# EAGLE schematic TX (EAGLE 6.4)
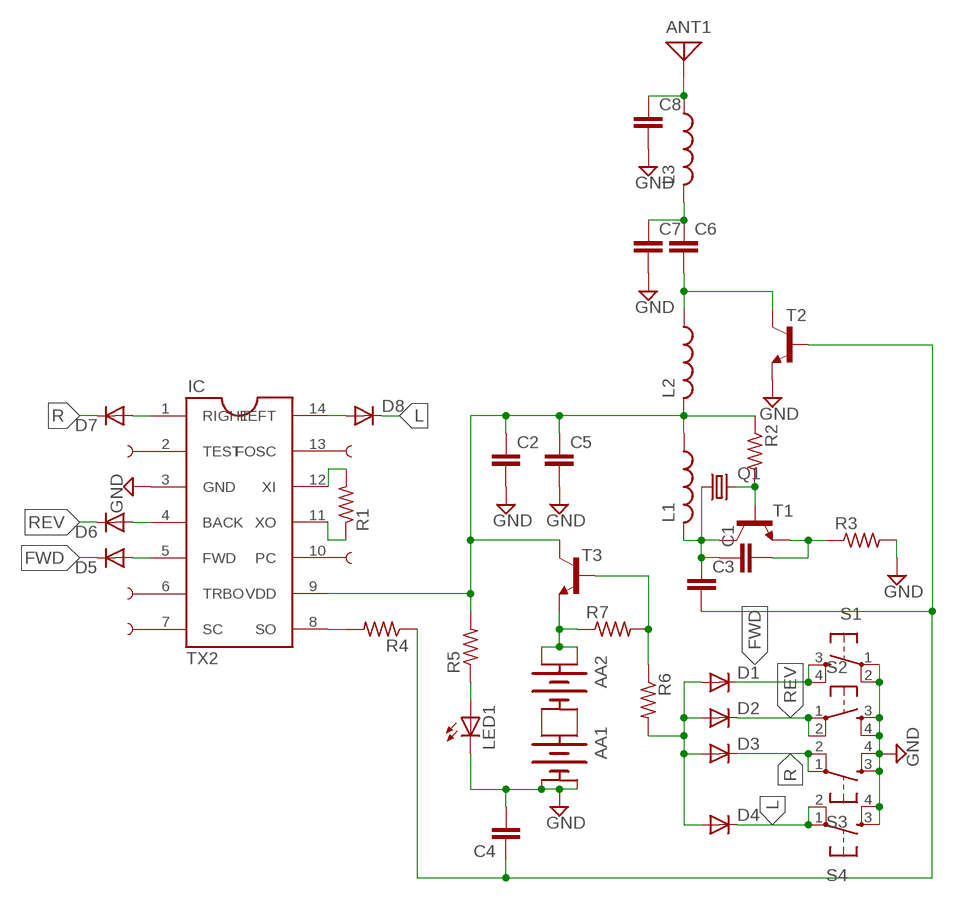
[diagram p0: schematic, sheet 1]

## Parts
AA1  BATTERY-2AA  [BATTERY-AA]
AA2  BATTERY-2AA  [BATTERY-AA]
ANT1  ANTENNA  [PAD-01]
C1  C-EU050-025X075  [C050-025X075]
C2  C-EU050-025X075  [C050-025X075]
C3  C-EU050-025X075  [C050-025X075]
C4  C-EU050-025X075  [C050-025X075]
C5  C-EU050-025X075  [C050-025X075]
C6  C-EU050-025X075  [C050-025X075]
C7  C-EU050-025X075  [C050-025X075]
C8  C-EU050-025X075  [C050-025X075]
D1  DIODE-DO35-10  [DO35-10]
D2  DIODE-DO35-10  [DO35-10]
D3  DIODE-DO35-10  [DO35-10]
D4  DIODE-DO35-10  [DO35-10]
D5  DIODE-DO35-10  [DO35-10]
D6  DIODE-DO35-10  [DO35-10]
D7  DIODE-DO35-10  [DO35-10]
D8  DIODE-DO35-10  [DO35-10]
IC  TX2  TX2TX2  [14-DIP]
L1  L-US0204/7  [0204/7]
L2  L-US0204/7  [0204/7]
L3  L-US6000-XXX-RC  [6000-XXXX-RC]
LED1  LED5MM  [LED5MM]
Q1  CRYSTALTC38H  [TC38H]
R1  R-US_0204/7  [0204/7]
R2  R-US_0204/7  [0204/7]
R3  R-US_0204/7  [0204/7]
R4  R-US_0204/7  [0204/7]
R5  R-US_0204/7  [0204/7]
R6  R-US_0204/7  [0204/7]
R7  R-US_0204/7  [0204/7]
S1  TAC_SWITCHPTH  [TACTILE-PTH]
S2  TAC_SWITCHPTH  [TACTILE-PTH]
S3  TAC_SWITCHPTH  [TACTILE-PTH]
S4  TAC_SWITCHPTH  [TACTILE-PTH]
T1  2SC1815  [TO92-ECB]
T2  2SC1815  [TO92-ECB]
T3  2SC1815  [TO92-ECB]
TP1  TEST-POINT3  [PAD.03X.03]
TP2  TEST-POINT3  [PAD.03X.03]
TP3  TEST-POINT3  [PAD.03X.03]
TP4  TEST-POINT3  [PAD.03X.03]
TP5  TEST-POINT3  [PAD.03X.03]

## Nets
FWD: D1.C D5.C S1.3 S1.4
GND: AA1.GND@1(-1) AA1.GND@2(-2) C2.2 C4.2 C5.2 C7.2 C8.2 IC.3(GND) LED1.K(C) R3.2 S1.1 S1.2 S2.3 S2.4 S3.3 S3.4 S4.3 S4.4 T2.E
L: D4.C D8.C S4.1 S4.2
N$1: AA1.PWR@2(+2) AA2.GND@2(-2)
N$2: AA1.PWR@1(+1) AA2.GND@1(-1)
N$3: ANT1.1 C8.1 L3.1
N$4: C6.1 C7.1 L3.2
N$5: C6.2 L2.1 T2.C
N$6: IC.13(FOSC) TP1.P$1
N$7: IC.10(PC) TP2.P$1
N$8: IC.2(TEST) TP3.P$1
N$9: IC.6(TRBO) TP4.P$1
N$10: IC.7(SC) TP5.P$1
N$11: C2.1 C5.1 IC.9(VDD) L1.1 L2.2 R2.1 R5.2 T3.C
N$12: LED1.A R5.1
N$13: AA2.PWR@1(+1) AA2.PWR@2(+2) R7.1 T3.E
N$14: Q1.2 R2.2 T1.B
N$15: R6.1 R7.2 T3.B
N$16: D1.A D2.A D3.A D4.A R6.2
N$17: C3.2 C4.1 R4.1 T2.B
N$18: C1.1 C3.1 L1.2 Q1.1 T1.C
N$19: IC.8(SO) R4.2
N$20: C1.2 R3.1 T1.E
N$21: D5.A IC.5(FWD)
N$22: D7.A IC.1(RIGHT)
N$23: D8.A IC.14(LEFT)
N$24: D6.A IC.4(BACK)
N$25: IC.12(XI) R1.2
N$26: IC.11(XO) R1.1
R: D3.C D7.C S3.1 S3.2
REV: D2.C D6.C S2.1 S2.2

## Library data of the parts
AA1 AA2 = SparkFun-Electromechanical:BATTERY-2: AA and AAA battery holders
ANT1 = discrete:ANTENNA: Antenna
C1-C8 = resistor:C-EU: CAPACITOR, European symbol
D1-D8 = diode:DIODE-: DIODE
IC = Dan:TX2
L1-L3 = rcl:L-US: INDUCTOR, American symbol
LED1 = led:LED: LED OSRAM: - CHIPLED LG R971, LG N971, LY N971, LG Q971, LY Q971, LO R971, LY R971 LH N974, LH R974 LS Q976, LO Q976, LY Q976 LO Q996 - Hyper CHIPLED LW Q18S LB Q993, LB Q99A, LB R99A - SideLED LS A670, LO A670, LY A670, LG A670, LP A670 LB A673, LV A673, LT A673, LW A673 LH A674 LY A675 LS A676, LA A676, LO A676, LY A676, LW A676 LS A679, LY A679, LG A679 - Hyper Micro SIDELED® LS Y876, LA Y876, LO Y876, LY Y876 LT Y87S - SmartLED LW L88C, LW L88S LB L89C, LB L89S, LG L890 LS L89K, LO L89K, LY L89K LS L896, LA L896, LO L896, LY L896 - TOPLED LS T670, LO T670, LY T670, LG T670, LP T670 LSG T670, LSP T670, LSY T670, LOP T670, LYG T670 LG T671, LOG T671, LSG T671 LB T673, LV T673, LT T673, LW T673 LH T674 LS T676, LA T676, LO T676, LY T676, LB T676, LH T676, LSB T676, LW T676 LB T67C, LV T67C, LT T67C, LS T67K, LO T67K, LY T67K, LW E67C LS E67B, LA E67B, LO E67B, LY E67B, LB E67C, LV E67C, LT E67C LW T67C LS T679, LY T679, LG T679 LS T770, LO T770, LY T770, LG T770, LP T770 LB T773, LV T773, LT T773, LW T773 LH T774 LS E675, LA E675, LY E675, LS T675 LS T776, LA T776, LO T776, LY T776, LB T776 LHGB T686 LT T68C, LB T68C - Hyper Mini TOPLED® LB M676 - Mini TOPLED Santana® LG M470 LS M47K, LO M47K, LY M47K Source: http://www.osram.convergy.de LUXEON: - LUMILED® LXK2-PW12-R00, LXK2-PW12-S00, LXK2-PW14-U00, LXK2-PW14-V00 LXK2-PM12-R00, LXK2-PM12-S00, LXK2-PM14-U00 LXK2-PE12-Q00, LXK2-PE12-R00, LXK2-PE12-S00, LXK2-PE14-T00, LXK2-PE14-U00 LXK2-PB12-K00, LXK2-PB12-L00, LXK2-PB12-M00, LXK2-PB14-N00, LXK2-PB14-P00, LXK2-PB14-Q00 LXK2-PR12-L00, LXK2-PR12-M00, LXK2-PR14-Q00, LXK2-PR14-R00 LXK2-PD12-Q00, LXK2-PD12-R00, LXK2-PD12-S00 LXK2-PH12-R00, LXK2-PH12-S00 LXK2-PL12-P00, LXK2-PL12-Q00, LXK2-PL12-R00 Source: www.luxeon.com KINGBRIGHT: KA-3528ASYC Source: www.kingbright.com
Q1 = crystal:CRYSTAL: CRYSTAL; OC_FARNELL: unknown; OC_NEWARK: unknown
R1-R7 = resistor:R-US_: RESISTOR, American symbol
S1-S4 = SparkFun-Electromechanical:TAC_SWITCH: Momentary Switch Button commonly used for reset or general input. Spark Fun Electronics SKU : COM-00097 SMT- SWCH-08247
T1-T3 = transistor:2SC1815: NPN EPITAXIAL TRANSISTOR Source: TOSHIBA .. 2SC1815 1.pdf
TP1-TP5 = SparkFun-Passives:TEST-POINT: Bare copper test points for troubleshooting or ICT